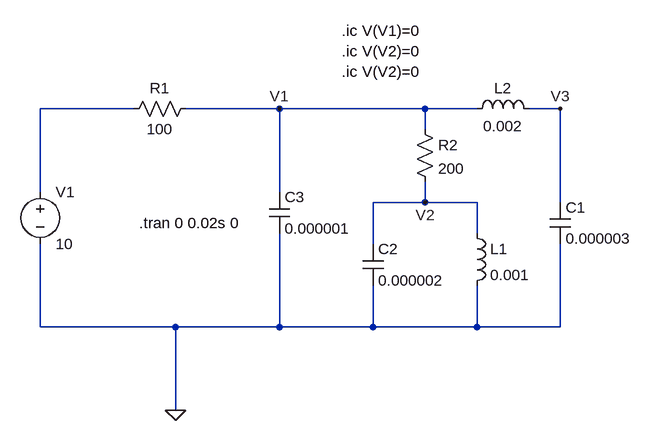
[diagram p0: schematic Q2.asc]
Q2.asc, the LTspice schematic file:
Version 4
SHEET 1 880 680
WIRE 0 128 -144 128
WIRE 224 128 80 128
WIRE 448 128 224 128
WIRE 528 128 448 128
WIRE 656 128 608 128
WIRE 448 160 448 128
WIRE -144 256 -144 128
WIRE 224 256 224 128
WIRE 448 272 448 240
WIRE 448 272 368 272
WIRE 528 272 448 272
WIRE 656 272 656 128
WIRE 528 320 528 272
WIRE 368 336 368 272
WIRE -144 464 -144 336
WIRE 64 464 -144 464
WIRE 224 464 224 320
WIRE 224 464 64 464
WIRE 368 464 368 400
WIRE 368 464 224 464
WIRE 528 464 528 400
WIRE 528 464 368 464
WIRE 656 464 656 336
WIRE 656 464 528 464
WIRE 64 592 64 464
FLAG 64 592 0
FLAG 224 128 V1
FLAG 448 272 V2
FLAG 656 128 V3
SYMBOL res 432 144 R0
SYMATTR InstName R2
SYMATTR Value 200
SYMBOL cap 640 272 R0
SYMATTR InstName C1
SYMATTR Value 0.000003
SYMBOL cap 352 336 R0
SYMATTR InstName C2
SYMATTR Value 0.000002
SYMBOL cap 208 256 R0
SYMATTR InstName C3
SYMATTR Value 0.000001
SYMBOL ind 512 304 R0
SYMATTR InstName L1
SYMATTR Value 0.001
SYMBOL ind 512 144 R270
WINDOW 0 32 56 VTop 2
WINDOW 3 5 56 VBottom 2
SYMATTR InstName L2
SYMATTR Value 0.002
SYMBOL voltage -144 240 R0
SYMATTR InstName V1
SYMATTR Value 10
SYMBOL res -16 144 R270
WINDOW 0 32 56 VTop 2
WINDOW 3 0 56 VBottom 2
SYMATTR InstName R1
SYMATTR Value 100
TEXT 8 304 Left 2 !.tran 0 0.02s 0
TEXT 320 8 Left 2 !.ic V(V1)=0\n.ic V(V2)=0\n.ic V(V2)=0

The netlist it stands for:
* Q2.asc
R2 V1 V2 200
C1 V3 0 0.000003
C2 V2 0 0.000002
C3 V1 0 0.000001
L1 V2 0 0.001
L2 V1 V3 0.002
V1 N001 0 10
R1 N001 V1 100
.tran 0 0.02s 0
.ic V(V1)=0
.ic V(V2)=0
.ic V(V2)=0
.backanno
.end